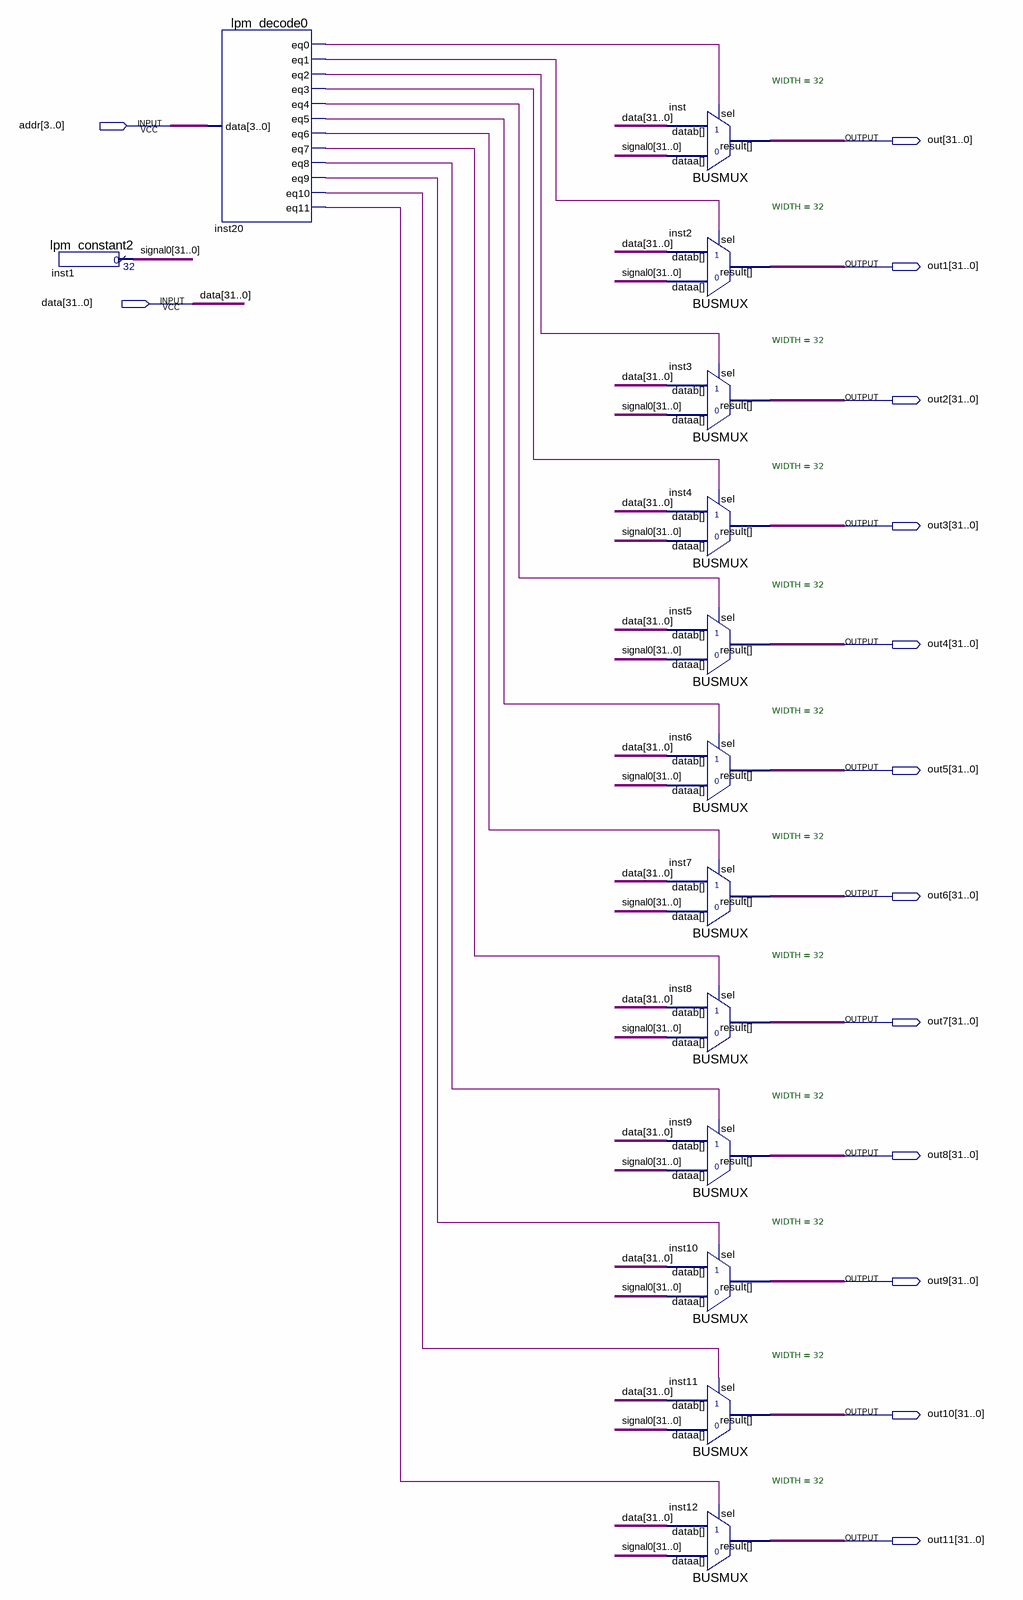
[diagram p0: schematic sheet]
// Quartus schematic demux2.bdf as structural Verilog: 14 symbols, 14 pins
module demux2 (
  input  [3:0] addr,
  input  [31:0] data,
  output [31:0] out,
  output [31:0] out1,
  output [31:0] out2,
  output [31:0] out3,
  output [31:0] out4,
  output [31:0] out5,
  output [31:0] out6,
  output [31:0] out7,
  output [31:0] out8,
  output [31:0] out9,
  output [31:0] out10,
  output [31:0] out11
);

  wire inst20_eq0, inst20_eq1, inst20_eq2, inst20_eq3, inst20_eq4, inst20_eq5, inst20_eq6, inst20_eq7,
       inst20_eq8, inst20_eq9, inst20_eq10, inst20_eq11;
  wire [31:0] signal0;

  lpm_constant2 inst1 (.result(signal0));
  lpm_decode0 inst20 (
    .data(addr), .eq0(inst20_eq0), .eq1(inst20_eq1), .eq2(inst20_eq2), .eq3(inst20_eq3), .eq4(inst20_eq4),
    .eq5(inst20_eq5), .eq6(inst20_eq6), .eq7(inst20_eq7), .eq8(inst20_eq8), .eq9(inst20_eq9),
    .eq10(inst20_eq10), .eq11(inst20_eq11));
  BUSMUX #(.WIDTH(32)) inst (.datab(data), .sel(inst20_eq0), .dataa(signal0), .result(out));
  BUSMUX #(.WIDTH(32)) inst2 (.datab(data), .sel(inst20_eq1), .dataa(signal0), .result(out1));
  BUSMUX #(.WIDTH(32)) inst3 (.datab(data), .sel(inst20_eq2), .dataa(signal0), .result(out2));
  BUSMUX #(.WIDTH(32)) inst4 (.datab(data), .sel(inst20_eq3), .dataa(signal0), .result(out3));
  BUSMUX #(.WIDTH(32)) inst5 (.datab(data), .sel(inst20_eq4), .dataa(signal0), .result(out4));
  BUSMUX #(.WIDTH(32)) inst6 (.datab(data), .sel(inst20_eq5), .dataa(signal0), .result(out5));
  BUSMUX #(.WIDTH(32)) inst7 (.datab(data), .sel(inst20_eq6), .dataa(signal0), .result(out6));
  BUSMUX #(.WIDTH(32)) inst8 (.datab(data), .sel(inst20_eq7), .dataa(signal0), .result(out7));
  BUSMUX #(.WIDTH(32)) inst9 (.datab(data), .sel(inst20_eq8), .dataa(signal0), .result(out8));
  BUSMUX #(.WIDTH(32)) inst10 (.datab(data), .sel(inst20_eq9), .dataa(signal0), .result(out9));
  BUSMUX #(.WIDTH(32)) inst11 (.datab(data), .sel(inst20_eq10), .dataa(signal0), .result(out10));
  BUSMUX #(.WIDTH(32)) inst12 (.datab(data), .sel(inst20_eq11), .dataa(signal0), .result(out11));
endmodule
